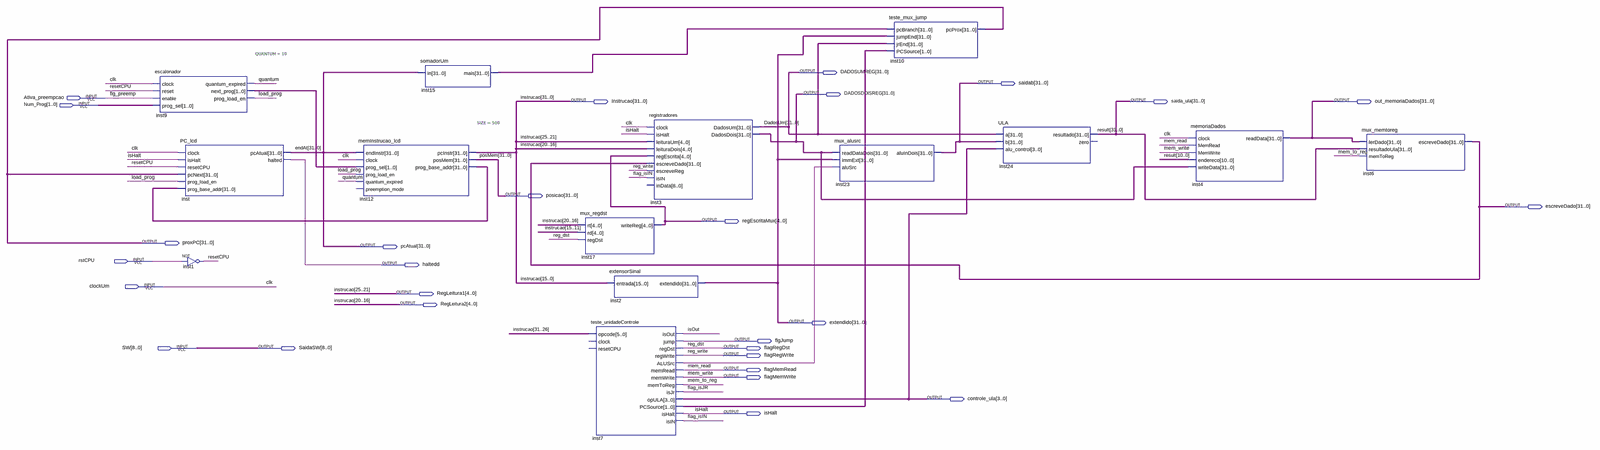
[diagram p0: schematic sheet, whole]
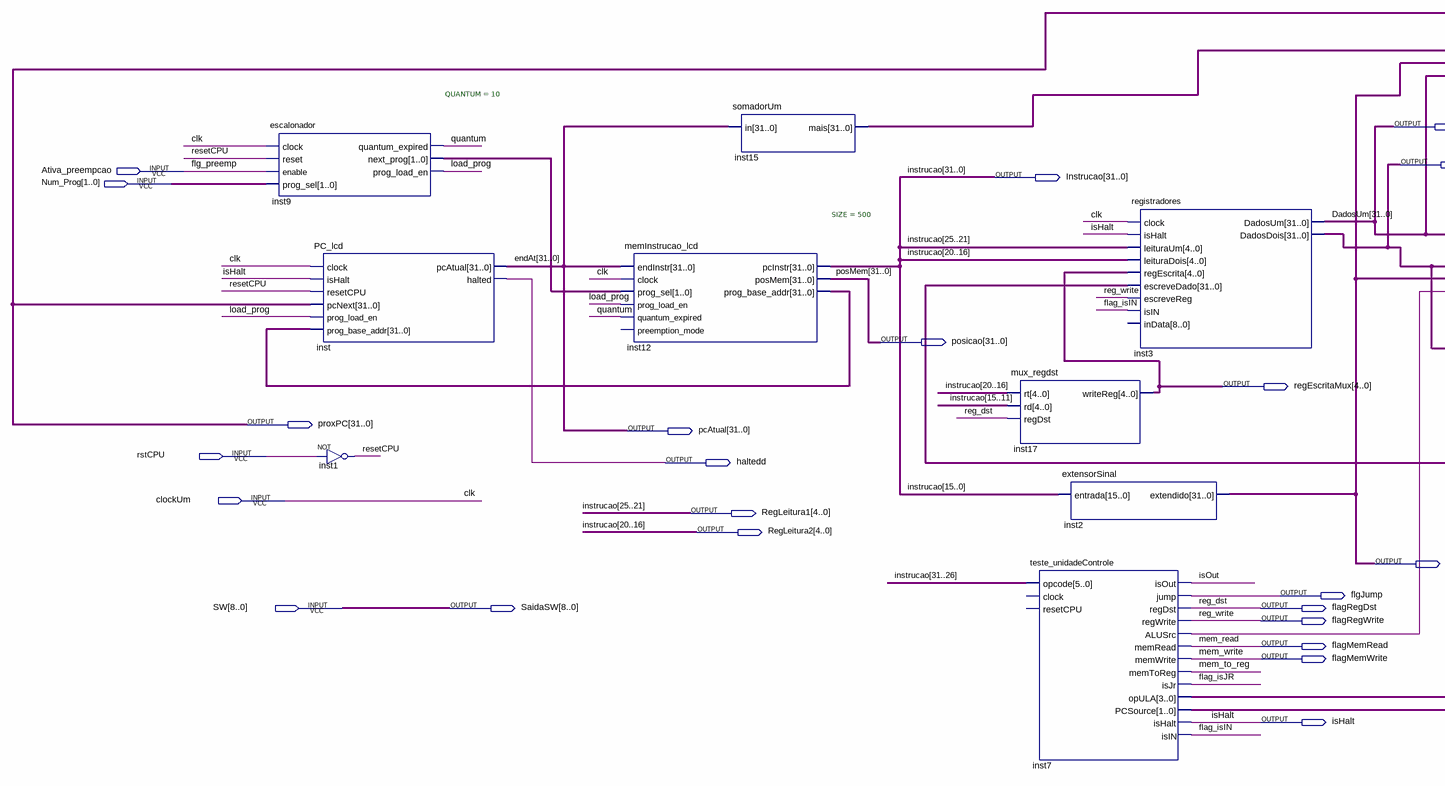
[diagram p1: schematic sheet, left part]
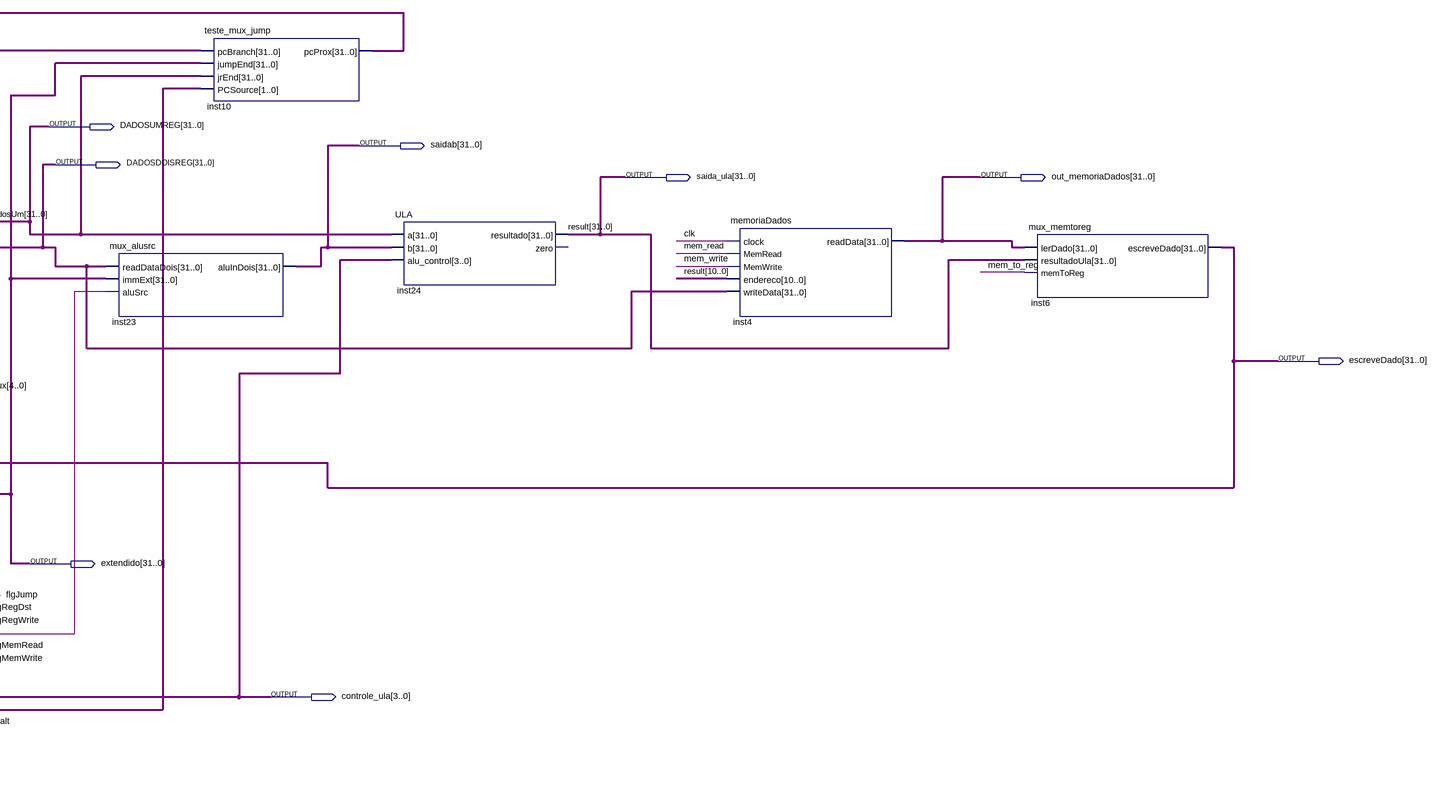
[diagram p2: schematic sheet, right part]
// Quartus schematic teste_Escalona_E_Progs.bdf as structural Verilog: 14 symbols, 28 pins
module teste_Escalona_E_Progs (
  input  Ativa_preempcao,
  input  [1:0] Num_Prog,
  input  rstCPU,
  input  clockUm,
  input  [8:0] SW,
  output [31:0] DADOSUMREG,
  output [31:0] saidab,
  output [31:0] DADOSDOISREG,
  output [31:0] Instrucao,
  output [31:0] saida_ula,
  output [31:0] out_memoriaDados,
  output [31:0] posicao,
  output [31:0] escreveDado,
  output [4:0] regEscritaMux,
  output [31:0] proxPC,
  output [31:0] pcAtual,
  output haltedd,
  output [4:0] RegLeitura1,
  output [4:0] RegLeitura2,
  output [31:0] extendido,
  output flgJump,
  output [8:0] SaidaSW,
  output flagRegDst,
  output flagRegWrite,
  output flagMemRead,
  output flagMemWrite,
  output [3:0] controle_ula,
  output isHalt
);

  wire flag_isIN, flag_isJR, inst7_alusrc, isOut, load_prog, mem_to_reg, quantum, resetCPU;
  wire [1:0] inst7_pcsource, inst9_next_prog;
  wire [31:0] inst12_prog_base_addr, inst15_mais;

  escalonador #(.QUANTUM(10)) inst9 (
    .clock(clockUm), .reset(resetCPU), .enable(Ativa_preempcao), .prog_sel(Num_Prog),
    .quantum_expired(quantum), .next_prog(inst9_next_prog), .prog_load_en(load_prog));
  PC_lcd inst (
    .clock(clockUm), .isHalt(isHalt), .resetCPU(resetCPU), .pcNext(proxPC), .prog_load_en(load_prog),
    .prog_base_addr(inst12_prog_base_addr), .pcAtual(pcAtual), .halted(haltedd));
  not inst1 (resetCPU, rstCPU);
  memInstrucao_lcd #(.SIZE(500)) inst12 (
    .endInstr(pcAtual), .clock(clockUm), .prog_sel(inst9_next_prog), .prog_load_en(load_prog),
    .quantum_expired(quantum), .pcInstr(Instrucao), .posMem(posicao), .prog_base_addr(inst12_prog_base_addr));  // open: preemption_mode
  somadorUm inst15 (.in(pcAtual), .mais(inst15_mais));
  mux_regdst inst17 (.rt(Instrucao[20:16]), .rd(Instrucao[15:11]), .regDst(flagRegDst), .writeReg(regEscritaMux));
  teste_unidadeControle inst7 (
    .opcode(Instrucao[31:26]), .isOut(isOut), .jump(flgJump), .regDst(flagRegDst), .regWrite(flagRegWrite),
    .ALUSrc(inst7_alusrc), .memRead(flagMemRead), .memWrite(flagMemWrite), .memToReg(mem_to_reg),
    .isJr(flag_isJR), .opULA(controle_ula), .PCSource(inst7_pcsource), .isHalt(isHalt), .isIN(flag_isIN));  // open: clock, resetCPU
  extensorSinal inst2 (.entrada(Instrucao[15:0]), .extendido(extendido));
  registradores inst3 (
    .clock(clockUm), .isHalt(isHalt), .leituraUm(Instrucao[25:21]), .leituraDois(Instrucao[20:16]),
    .regEscrita(regEscritaMux), .escreveDado(escreveDado), .escreveReg(flagRegWrite), .isIN(flag_isIN),
    .DadosUm(DADOSUMREG), .DadosDois(DADOSDOISREG));  // open: inData
  mux_alusrc inst23 (.readDataDois(DADOSDOISREG), .immExt(extendido), .aluSrc(inst7_alusrc), .aluInDois(saidab));
  teste_mux_jump inst10 (
    .pcBranch(inst15_mais), .jumpEnd(extendido), .jrEnd(DADOSUMREG), .PCSource(inst7_pcsource),
    .pcProx(proxPC));
  ULA inst24 (.a(DADOSUMREG), .b(saidab), .alu_control(controle_ula), .resultado(saida_ula));  // open: zero
  memoriaDados inst4 (
    .clock(clockUm), .MemRead(flagMemRead), .MemWrite(flagMemWrite), .endereco(saida_ula[10:0]),
    .writeData(DADOSDOISREG), .readData(out_memoriaDados));
  mux_memtoreg inst6 (
    .lerDado(out_memoriaDados), .resultadoUla(saida_ula), .memToReg(mem_to_reg), .escreveDado(escreveDado));

  assign RegLeitura1 = Instrucao[25:21];
  assign RegLeitura2 = Instrucao[20:16];
  assign SaidaSW = SW;

  // Other names for the same wires on the sheet: clk = clockUm; DadosUm[31:0] = DADOSUMREG; endAt[31:0] = pcAtual;
  //   flg_preemp = Ativa_preempcao; mem_read = flagMemRead; mem_write = flagMemWrite; posMem[31:0] = posicao;
  //   reg_dst = flagRegDst; reg_write = flagRegWrite; result[31:0] = saida_ula
endmodule
